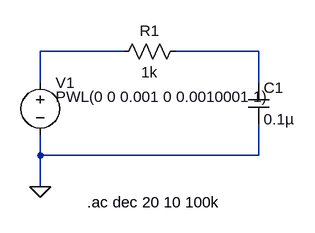
[diagram p0: schematic 01_lpf_freq.asc]
01_lpf_freq.asc, the LTspice schematic file:
Version 4
SHEET 1 880 680
WIRE 0 176 -128 176
WIRE 208 176 80 176
WIRE -128 224 -128 176
WIRE 208 224 208 176
WIRE -128 336 -128 304
WIRE 208 336 208 288
WIRE 208 336 -128 336
WIRE -128 384 -128 336
FLAG -128 384 0
SYMBOL cap 192 224 R0
SYMATTR InstName C1
SYMATTR Value 0.1µ
SYMBOL res -16 192 R270
WINDOW 0 32 56 VTop 2
WINDOW 3 0 56 VBottom 2
SYMATTR InstName R1
SYMATTR Value 1k
SYMBOL voltage -128 208 R0
WINDOW 3 24 38 Left 2
SYMATTR InstName V1
SYMATTR Value PWL(0 0 0.001 0 0.0010001 1)
SYMATTR Value2 AC 1 0
TEXT -56 408 Left 2 !.ac dec 20 10 100k

The netlist it stands for:
* 01_lpf_freq.asc
C1 N002 0 0.1µ
R1 N001 N002 1k
V1 N001 0 PWL(0 0 0.001 0 0.0010001 1) AC 1 0
.ac dec 20 10 100k
.backanno
.end